# EAGLE design board (EAGLE 6.4)
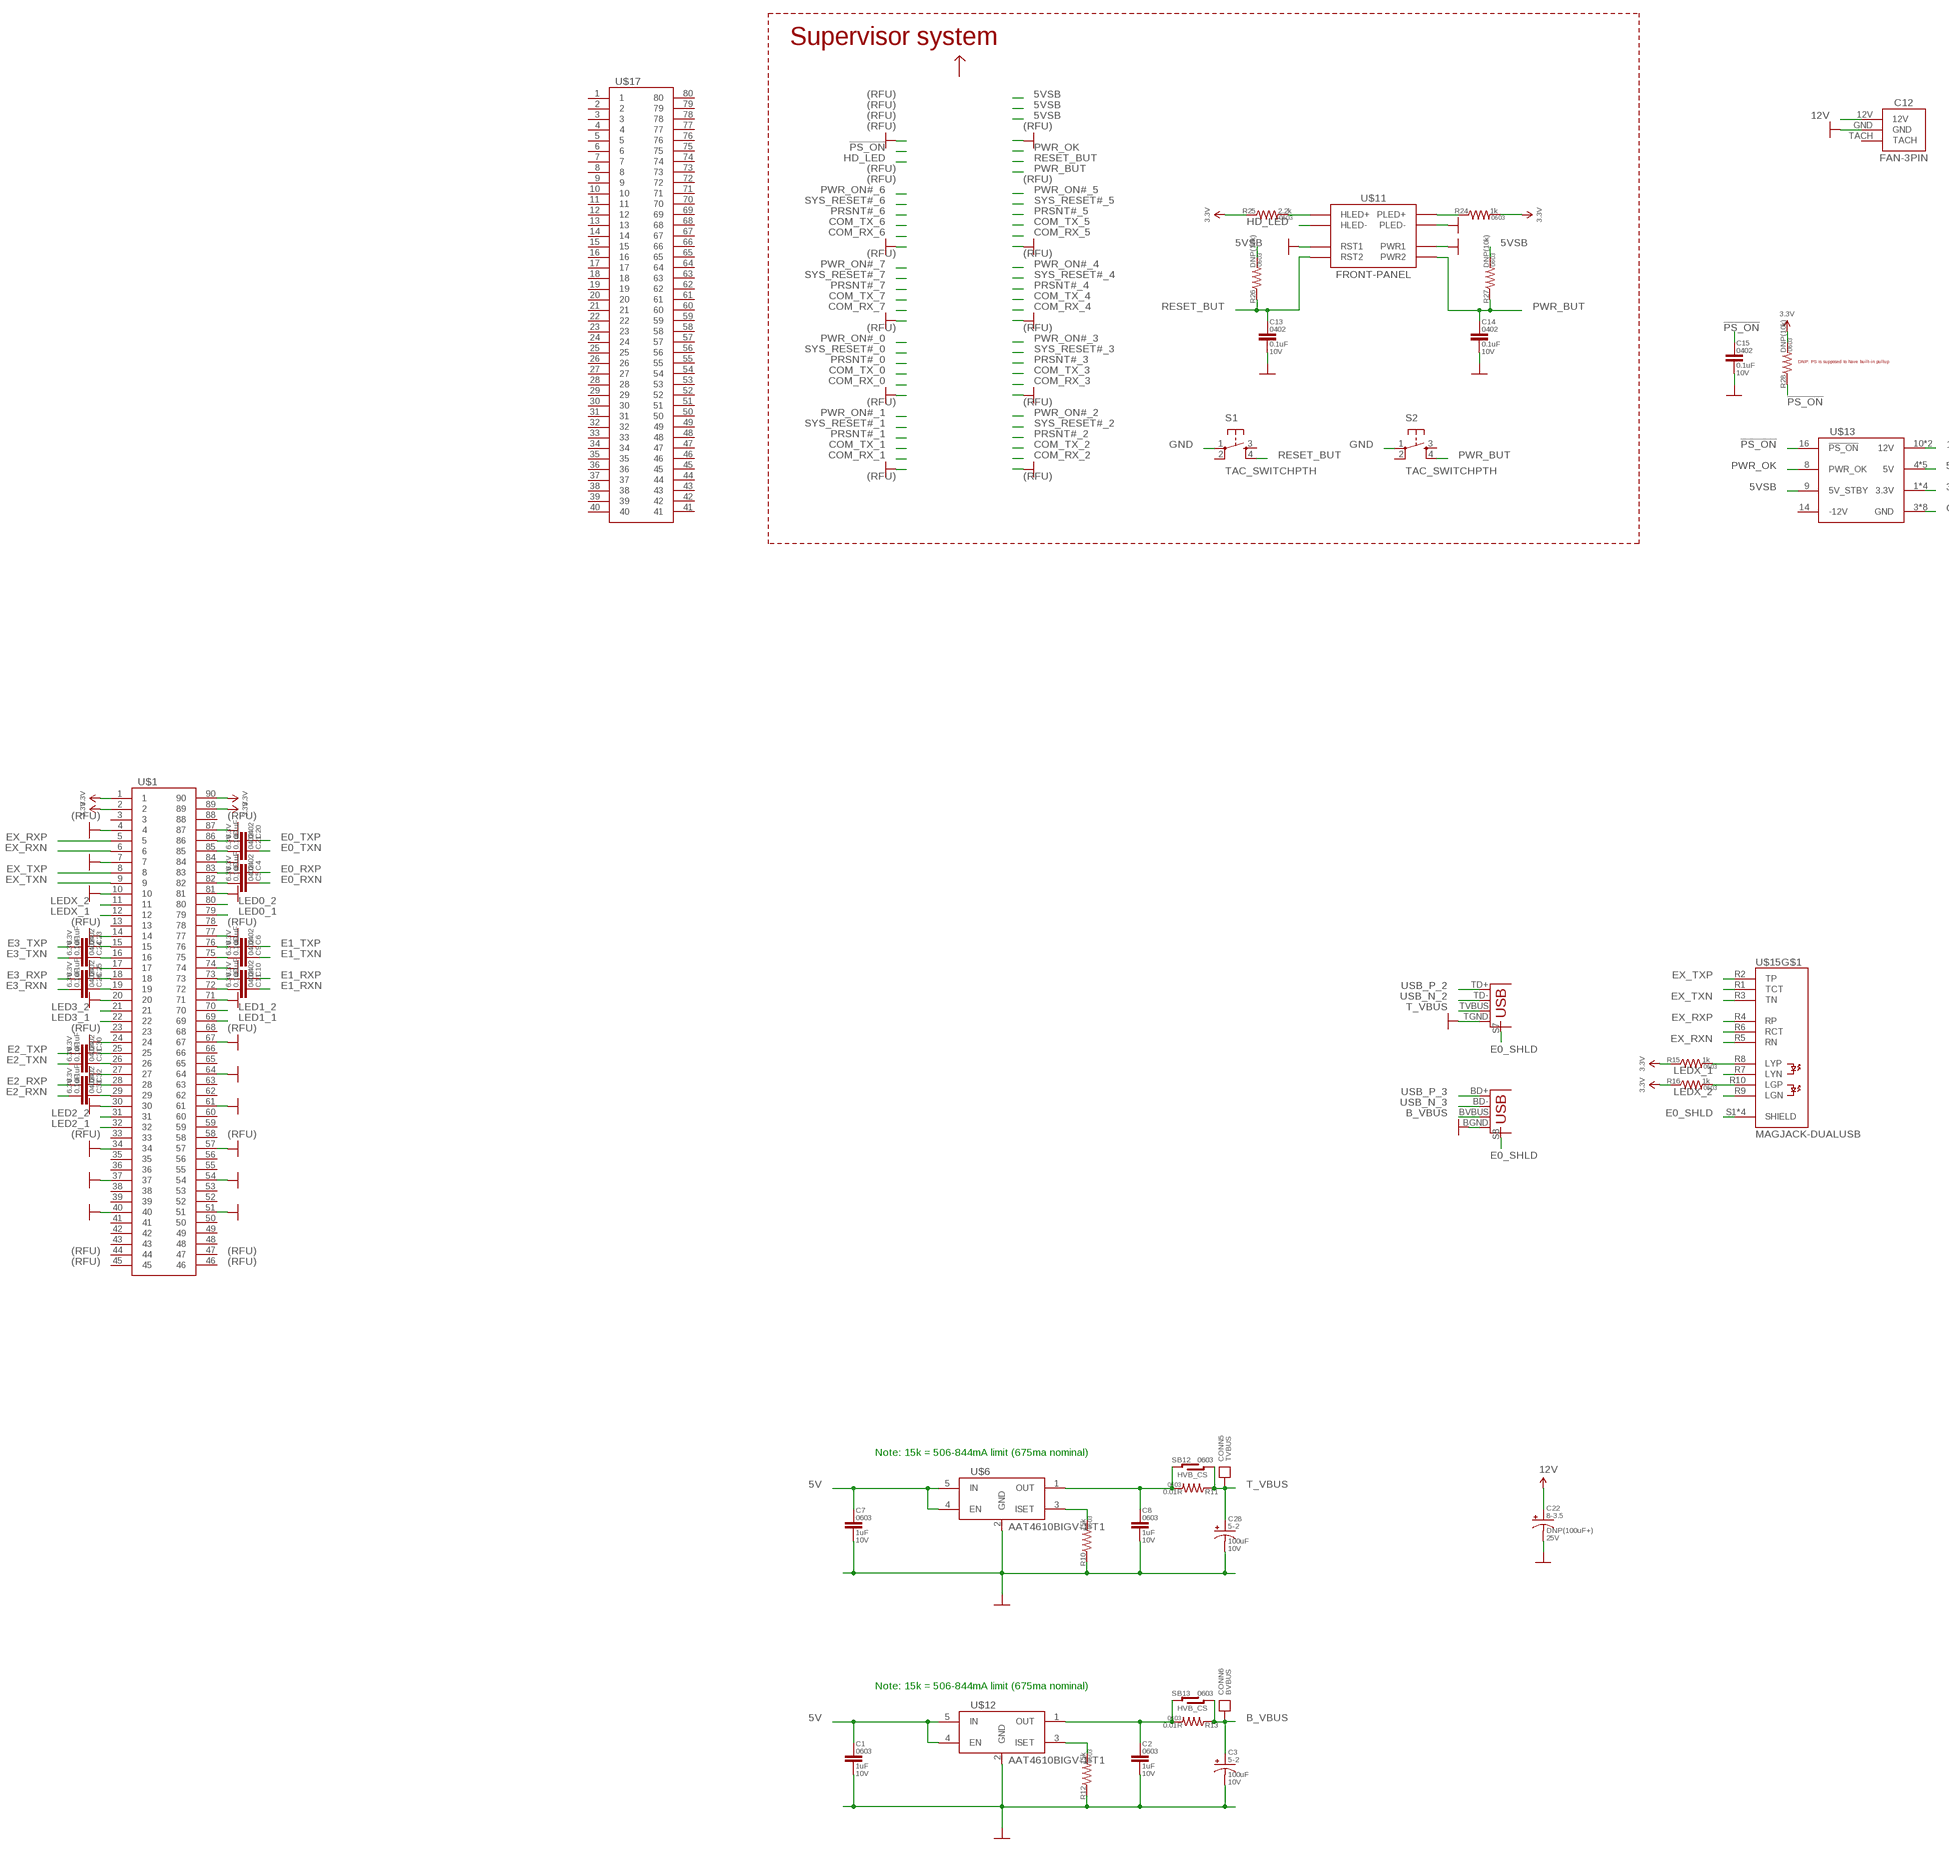
[diagram p0: schematic, sheet 1, part 1 of 2]
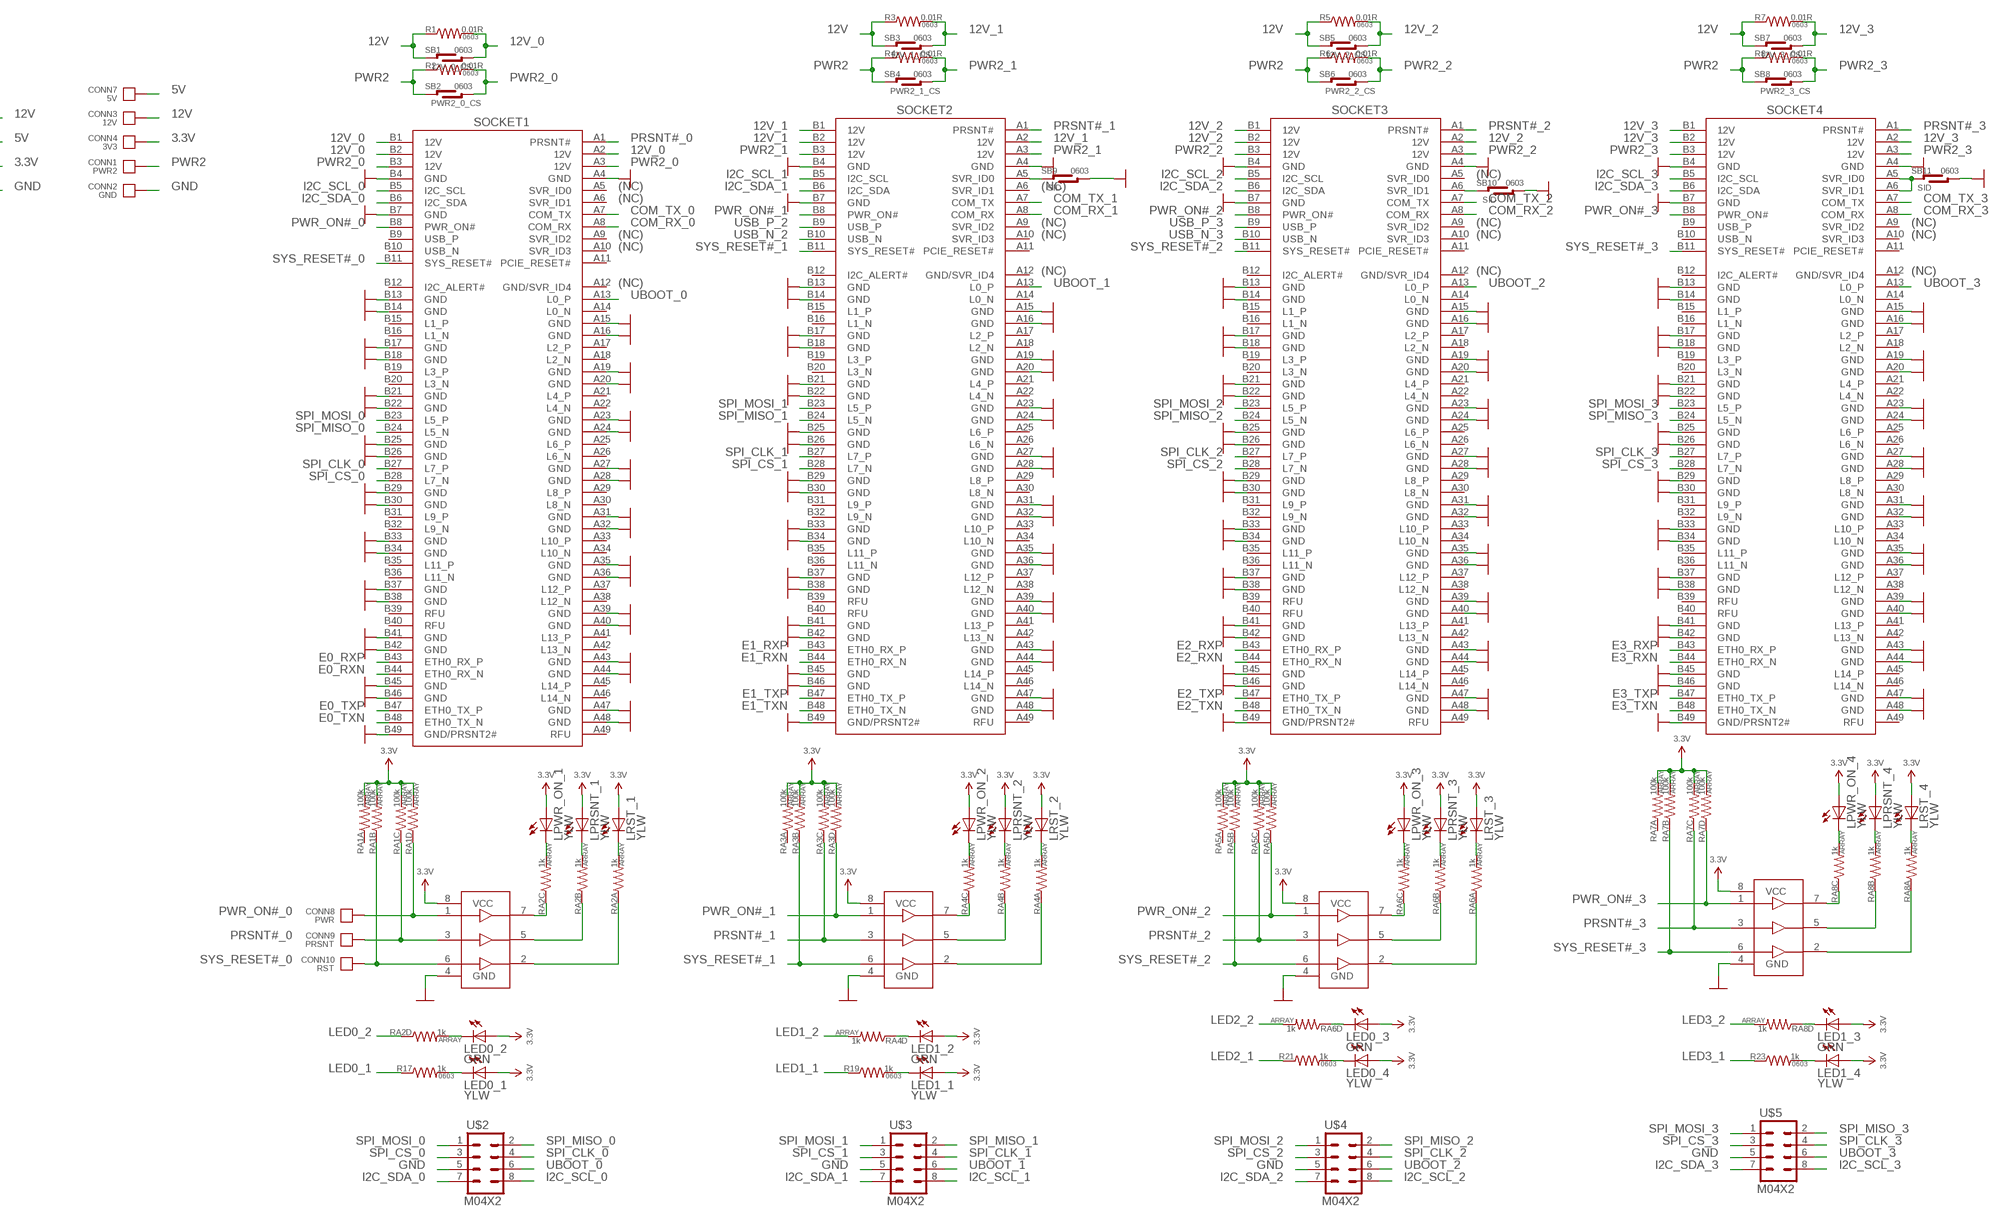
[diagram p1: schematic, sheet 1, part 2 of 2]

## Parts
C1  1uF  CAP0603  [0603-CAP]
C2  1uF  CAP0603  [0603-CAP]
C3  100uF  CAP_POLPTH-5-2  [CAP-5-2]
C4  0.1uF  CAP0402-CAP  [0402-CAP]
C5  0.1uF  CAP0402-CAP  [0402-CAP]
C6  0.1uF  CAP0402-CAP  [0402-CAP]
C7  1uF  CAP0603  [0603-CAP]
C8  1uF  CAP0603  [0603-CAP]
C9  0.1uF  CAP0402-CAP  [0402-CAP]
C10  0.1uF  CAP0402-CAP  [0402-CAP]
C11  0.1uF  CAP0402-CAP  [0402-CAP]
C12  FAN-3PIN  [FAN-3PIN]
C13  0.1uF  CAP0402-CAP  [0402-CAP]
C14  0.1uF  CAP0402-CAP  [0402-CAP]
C15  0.1uF  CAP0402-CAP  [0402-CAP]
C20  0.1uF  CAP0402-CAP  [0402-CAP]
C21  0.1uF  CAP0402-CAP  [0402-CAP]
C22  DNP(100uF+)  CAP_POLPTH-8-3.5  [CAP-8-3.5]
C23  0.1uF  CAP0402-CAP  [0402-CAP]
C24  0.1uF  CAP0402-CAP  [0402-CAP]
C25  0.1uF  CAP0402-CAP  [0402-CAP]
C26  0.1uF  CAP0402-CAP  [0402-CAP]
C28  100uF  CAP_POLPTH-5-2  [CAP-5-2]
C30  0.1uF  CAP0402-CAP  [0402-CAP]
C31  0.1uF  CAP0402-CAP  [0402-CAP]
C32  0.1uF  CAP0402-CAP  [0402-CAP]
C33  0.1uF  CAP0402-CAP  [0402-CAP]
CONN1  PWR2  CONNECTOR18AWG  [HOLE_18AWG]
CONN2  GND  CONNECTOR18AWG  [HOLE_18AWG]
CONN3  12V  CONNECTOR18AWG  [HOLE_18AWG]
CONN4  3V3  CONNECTOR18AWG  [HOLE_18AWG]
CONN5  TVBUS  CONNECTOR22AWG  [HOLE_22AWG]
CONN6  BVBUS  CONNECTOR22AWG  [HOLE_22AWG]
CONN7  5V  CONNECTOR18AWG  [HOLE_18AWG]
CONN8  PWR  CONNECTOR1.27  [TESTPAD-1.27]
CONN9  PRSNT  CONNECTOR1.27  [TESTPAD-1.27]
CONN10  RST  CONNECTOR1.27  [TESTPAD-1.27]
IC1  74X3G34  [TSSOP8]
IC2  74X3G34  [TSSOP8]
IC3  74X3G34  [TSSOP8]
IC4  74X3G34  [TSSOP8]
LED0_1  YLW  LED0603  [0603_LED]
LED0_2  GRN  LED0603  [0603_LED]
LED0_3  GRN  LED0603  [0603_LED]
LED0_4  YLW  LED0603  [0603_LED]
LED1_1  YLW  LED0603  [0603_LED]
LED1_2  GRN  LED0603  [0603_LED]
LED1_3  GRN  LED0603  [0603_LED]
LED1_4  YLW  LED0603  [0603_LED]
LPRSNT_1  YLW  LED0603  [0603_LED]
LPRSNT_2  YLW  LED0603  [0603_LED]
LPRSNT_3  YLW  LED0603  [0603_LED]
LPRSNT_4  YLW  LED0603  [0603_LED]
LPWR_ON_1  YLW  LED0603  [0603_LED]
LPWR_ON_2  YLW  LED0603  [0603_LED]
LPWR_ON_3  YLW  LED0603  [0603_LED]
LPWR_ON_4  YLW  LED0603  [0603_LED]
LRST_1  YLW  LED0603  [0603_LED]
LRST_2  YLW  LED0603  [0603_LED]
LRST_3  YLW  LED0603  [0603_LED]
LRST_4  YLW  LED0603  [0603_LED]
R1  0.01R  RESISTOR0603  [0603-RES]
R2  0.01R  RESISTOR0603  [0603-RES]
R3  0.01R  RESISTOR0603  [0603-RES]
R4  0.01R  RESISTOR0603  [0603-RES]
R5  0.01R  RESISTOR0603  [0603-RES]
R6  0.01R  RESISTOR0603  [0603-RES]
R7  0.01R  RESISTOR0603  [0603-RES]
R8  0.01R  RESISTOR0603  [0603-RES]
R10  15k  RESISTOR0603  [0603-RES]
R11  0.01R  RESISTOR0603  [0603-RES]
R12  15k  RESISTOR0603  [0603-RES]
R13  0.01R  RESISTOR0603  [0603-RES]
R15  1k  RESISTOR0603  [0603-RES]
R16  1k  RESISTOR0603  [0603-RES]
R17  1k  RESISTOR0603  [0603-RES]
R19  1k  RESISTOR0603  [0603-RES]
R21  1k  RESISTOR0603  [0603-RES]
R23  1k  RESISTOR0603  [0603-RES]
R24  1k  RESISTOR0603  [0603-RES]
R25  2.2k  RESISTOR0603  [0603-RES]
R26  DNP(10k)  RESISTOR0603  [0603-RES]
R27  DNP(10k)  RESISTOR0603  [0603-RES]
R28  DNP(10k)  RESISTOR0603  [0603-RES]
RA1  100k  RESISTOR_ARRAY0603_X4  [0603-ARV]
RA2  1k  RESISTOR_ARRAY0603_X4  [0603-ARV]
RA3  100k  RESISTOR_ARRAY0603_X4  [0603-ARV]
RA4  1k  RESISTOR_ARRAY0603_X4  [0603-ARV]
RA5  100k  RESISTOR_ARRAY0603_X4  [0603-ARV]
RA6  1k  RESISTOR_ARRAY0603_X4  [0603-ARV]
RA7  100k  RESISTOR_ARRAY0603_X4  [0603-ARV]
RA8  1k  RESISTOR_ARRAY0603_X4  [0603-ARV]
S1  TAC_SWITCHPTH  [TACTILE-PTH]
S2  TAC_SWITCHPTH  [TACTILE-PTH]
SB1  12V_0_CS  SOLDER-BRIDGE0603  [SB-0603]
SB2  PWR2_0_CS  SOLDER-BRIDGE0603  [SB-0603]
SB3  12V_1_CS  SOLDER-BRIDGE0603  [SB-0603]
SB4  PWR2_1_CS  SOLDER-BRIDGE0603  [SB-0603]
SB5  12V_2_CS  SOLDER-BRIDGE0603  [SB-0603]
SB6  PWR2_2_CS  SOLDER-BRIDGE0603  [SB-0603]
SB7  12V_3_CS  SOLDER-BRIDGE0603  [SB-0603]
SB8  PWR2_3_CS  SOLDER-BRIDGE0603  [SB-0603]
SB9  SID  SOLDER-BRIDGE0603  [SB-0603]
SB10  SID  SOLDER-BRIDGE0603  [SB-0603]
SB11  SID  SOLDER-BRIDGE0603  [SB-0603]
SB12  HVB_CS  SOLDER-BRIDGE0603  [SB-0603]
SB13  HVB_CS  SOLDER-BRIDGE0603  [SB-0603]
SOCKET1  COVEN-V1CONN  [CVN-V1-CONN]
SOCKET2  COVEN-V1CONN  [CVN-V1-CONN]
SOCKET3  COVEN-V1CONN  [CVN-V1-CONN]
SOCKET4  COVEN-V1CONN  [CVN-V1-CONN]
U$1  DF40-90RCP  [DF40-RCP-90]
U$2  M04X2  [2X4]
U$3  M04X2  [2X4]
U$4  M04X2  [2X4]
U$5  M04X2  [2X4]
U$6  AAT4610BIGV-1-T1  LOAD_SWITCH_ILIMIT  [SOT23-5]
U$11  FRONT-PANEL  [FRONT-PANEL]
U$12  AAT4610BIGV-1-T1  LOAD_SWITCH_ILIMIT  [SOT23-5]
U$13  ATX-PWRVERT  [ATX-24-VERT]
U$15  MAGJACK-DUALUSB  [MAGJACK-DUALUSB]
U$17  DF40-80RCP  [DF40-RCP-80]

## Nets
3.3V: CONN4.P$1(P) IC1.8(VCC) IC2.8(VCC) IC3.8(VCC) IC4.8(VCC) LED0_1.A LED0_2.A LED0_3.A LED0_4.A LED1_1.A LED1_2.A LED1_3.A LED1_4.A LPRSNT_1.A LPRSNT_2.A LPRSNT_3.A LPRSNT_4.A LPWR_ON_1.A LPWR_ON_2.A LPWR_ON_3.A LPWR_ON_4.A LRST_1.A LRST_2.A LRST_3.A LRST_4.A R15.1 R16.1 R24.2 R25.1 R28.2 RA1.5 RA1.6 RA1.7 RA1.8 RA3.5 RA3.6 RA3.7 RA3.8 RA5.5 RA5.6 RA5.7 RA5.8 RA7.5 RA7.6 RA7.7 RA7.8 U$1.1 U$1.2 U$1.89 U$1.90 U$13.1(3.3V) U$13.2(3.3V) U$13.12(3.3V) U$13.13(3.3V)
5V: C1.1 C7.1 CONN7.P$1(P) U$6.4(EN) U$6.5(IN) U$12.4(EN) U$12.5(IN) U$13.4(5V) U$13.6(5V) U$13.21(5V) U$13.22(5V) U$13.23(5V)
5VSB: R26.2 R27.2 U$13.9(5V_STBY)
12V: C12.12V C22.1(+) CONN3.P$1(P) R1.1 R3.1 R5.1 R7.1 SB1.L1 SB1.L2 SB3.L1 SB3.L2 SB5.L1 SB5.L2 SB7.L1 SB7.L2 U$13.10(12V) U$13.11(12V)
12V_0: R1.2 SB1.R1 SB1.R2 SOCKET1.A2(12V) SOCKET1.B1(12V) SOCKET1.B2(12V)
12V_1: R3.2 SB3.R1 SB3.R2 SOCKET2.A2(12V) SOCKET2.B1(12V) SOCKET2.B2(12V)
12V_2: R5.2 SB5.R1 SB5.R2 SOCKET3.A2(12V) SOCKET3.B1(12V) SOCKET3.B2(12V)
12V_3: R7.2 SB7.R1 SB7.R2 SOCKET4.A2(12V) SOCKET4.B1(12V) SOCKET4.B2(12V)
!PS_ON: C15.1 R28.1 U$13.16(!PS_ON)
B_VBUS: C3.1(+) CONN6.P R13.1 SB13.R1 SB13.R2 U$15.BVBUS(VBUS)
COM_RX_0: SOCKET1.A8(COM_RX)
COM_RX_1: SOCKET2.A8(COM_RX)
COM_RX_2: SOCKET3.A8(COM_RX)
COM_RX_3: SOCKET4.A8(COM_RX)
COM_TX_0: SOCKET1.A7(COM_TX)
COM_TX_1: SOCKET2.A7(COM_TX)
COM_TX_2: SOCKET3.A7(COM_TX)
COM_TX_3: SOCKET4.A7(COM_TX)
E0_RXN: C5.1 SOCKET1.B44(ETH0_RX_N)
E0_RXP: C4.1 SOCKET1.B43(ETH0_RX_P)
E0_SHLD: U$15.S1(SHIELD) U$15.S2(SHIELD) U$15.S3(SHIELD) U$15.S4(SHIELD) U$15.S7(SHELL) U$15.S8(SHELL)
E0_TXN: C21.1 SOCKET1.B48(ETH0_TX_N)
E0_TXP: C20.1 SOCKET1.B47(ETH0_TX_P)
E1_RXN: C11.1 SOCKET2.B44(ETH0_RX_N)
E1_RXP: C10.1 SOCKET2.B43(ETH0_RX_P)
E1_TXN: C9.1 SOCKET2.B48(ETH0_TX_N)
E1_TXP: C6.1 SOCKET2.B47(ETH0_TX_P)
E2_RXN: C33.2 SOCKET3.B44(ETH0_RX_N)
E2_RXP: C32.2 SOCKET3.B43(ETH0_RX_P)
E2_TXN: C31.2 SOCKET3.B48(ETH0_TX_N)
E2_TXP: C30.2 SOCKET3.B47(ETH0_TX_P)
E3_RXN: C26.2 SOCKET4.B44(ETH0_RX_N)
E3_RXP: C25.2 SOCKET4.B43(ETH0_RX_P)
E3_TXN: C24.2 SOCKET4.B48(ETH0_TX_N)
E3_TXP: C23.2 SOCKET4.B47(ETH0_TX_P)
EX_RXN: U$1.6 U$15.R5(RN)
EX_RXP: U$1.5 U$15.R4(RP)
EX_TXN: U$1.9 U$15.R3(TN)
EX_TXP: U$1.8 U$15.R2(TP)
GND: C1.2 C2.2 C3.2(-) C7.2 C8.2 C12.GND C13.2 C14.2 C15.2 C22.2(-) C28.2(-) CONN2.P$1(P) IC1.4(GND) IC2.4(GND) IC3.4(GND) IC4.4(GND) R10.1 R12.1 S1.1 S2.1 SB9.R1 SB9.R2 SB10.R1 SB10.R2 SB11.R1 SB11.R2 SOCKET1.A4(GND) SOCKET1.A15(GND) SOCKET1.A16(GND) SOCKET1.A19(GND) SOCKET1.A20(GND) SOCKET1.A23(GND) SOCKET1.A24(GND) SOCKET1.A27(GND) SOCKET1.A28(GND) SOCKET1.A31(GND) SOCKET1.A32(GND) SOCKET1.A35(GND) SOCKET1.A36(GND) SOCKET1.A39(GND) SOCKET1.A40(GND) SOCKET1.A43(GND) SOCKET1.A44(GND) SOCKET1.A47(GND) SOCKET1.A48(GND) SOCKET1.B4(GND) SOCKET1.B7(GND) SOCKET1.B13(GND) SOCKET1.B14(GND) SOCKET1.B17(GND) SOCKET1.B18(GND) SOCKET1.B21(GND) SOCKET1.B22(GND) SOCKET1.B25(GND) SOCKET1.B26(GND) SOCKET1.B29(GND) SOCKET1.B30(GND) SOCKET1.B33(GND) SOCKET1.B34(GND) SOCKET1.B37(GND) SOCKET1.B38(GND) SOCKET1.B41(GND) SOCKET1.B42(GND) SOCKET1.B45(GND) SOCKET1.B46(GND) SOCKET1.B49(GND/PRSNT2#) SOCKET2.A4(GND) SOCKET2.A15(GND) SOCKET2.A16(GND) SOCKET2.A19(GND) SOCKET2.A20(GND) SOCKET2.A23(GND) SOCKET2.A24(GND) SOCKET2.A27(GND) SOCKET2.A28(GND) SOCKET2.A31(GND) SOCKET2.A32(GND) SOCKET2.A35(GND) SOCKET2.A36(GND) SOCKET2.A39(GND) SOCKET2.A40(GND) SOCKET2.A43(GND) SOCKET2.A44(GND) SOCKET2.A47(GND) SOCKET2.A48(GND) SOCKET2.B4(GND) SOCKET2.B7(GND) SOCKET2.B13(GND) SOCKET2.B14(GND) SOCKET2.B17(GND) SOCKET2.B18(GND) SOCKET2.B21(GND) SOCKET2.B22(GND) SOCKET2.B25(GND) SOCKET2.B26(GND) SOCKET2.B29(GND) SOCKET2.B30(GND) SOCKET2.B33(GND) SOCKET2.B34(GND) SOCKET2.B37(GND) SOCKET2.B38(GND) SOCKET2.B41(GND) SOCKET2.B42(GND) SOCKET2.B45(GND) SOCKET2.B46(GND) SOCKET2.B49(GND/PRSNT2#) SOCKET3.A4(GND) SOCKET3.A15(GND) SOCKET3.A16(GND) SOCKET3.A19(GND) SOCKET3.A20(GND) SOCKET3.A23(GND) SOCKET3.A24(GND) SOCKET3.A27(GND) SOCKET3.A28(GND) SOCKET3.A31(GND) SOCKET3.A32(GND) SOCKET3.A35(GND) SOCKET3.A36(GND) SOCKET3.A39(GND) SOCKET3.A40(GND) SOCKET3.A43(GND) SOCKET3.A44(GND) SOCKET3.A47(GND) SOCKET3.A48(GND) SOCKET3.B4(GND) SOCKET3.B7(GND) SOCKET3.B13(GND) SOCKET3.B14(GND) SOCKET3.B17(GND) SOCKET3.B18(GND) SOCKET3.B21(GND) SOCKET3.B22(GND) SOCKET3.B25(GND) SOCKET3.B26(GND) SOCKET3.B29(GND) SOCKET3.B30(GND) SOCKET3.B33(GND) SOCKET3.B34(GND) SOCKET3.B37(GND) SOCKET3.B38(GND) SOCKET3.B41(GND) SOCKET3.B42(GND) SOCKET3.B45(GND) SOCKET3.B46(GND) SOCKET3.B49(GND/PRSNT2#) SOCKET4.A4(GND) SOCKET4.A15(GND) SOCKET4.A16(GND) SOCKET4.A19(GND) SOCKET4.A20(GND) SOCKET4.A23(GND) SOCKET4.A24(GND) SOCKET4.A27(GND) SOCKET4.A28(GND) SOCKET4.A31(GND) SOCKET4.A32(GND) SOCKET4.A35(GND) SOCKET4.A36(GND) SOCKET4.A39(GND) SOCKET4.A40(GND) SOCKET4.A43(GND) SOCKET4.A44(GND) SOCKET4.A47(GND) SOCKET4.A48(GND) SOCKET4.B4(GND) SOCKET4.B7(GND) SOCKET4.B13(GND) SOCKET4.B14(GND) SOCKET4.B17(GND) SOCKET4.B18(GND) SOCKET4.B21(GND) SOCKET4.B22(GND) SOCKET4.B25(GND) SOCKET4.B26(GND) SOCKET4.B29(GND) SOCKET4.B30(GND) SOCKET4.B33(GND) SOCKET4.B34(GND) SOCKET4.B37(GND) SOCKET4.B38(GND) SOCKET4.B41(GND) SOCKET4.B42(GND) SOCKET4.B45(GND) SOCKET4.B46(GND) SOCKET4.B49(GND/PRSNT2#) U$1.4 U$1.7 U$1.10 U$1.14 U$1.17 U$1.20 U$1.24 U$1.27 U$1.30 U$1.34 U$1.37 U$1.40 U$1.51 U$1.54 U$1.57 U$1.61 U$1.64 U$1.67 U$1.71 U$1.74 U$1.77 U$1.81 U$1.84 U$1.87 U$2.5 U$3.5 U$4.5 U$5.5 U$6.2(GND) U$11.PLED- U$11.PWR_1(PWR1) U$11.RST_1(RST1) U$12.2(GND) U$13.3(GND) U$13.5(GND) U$13.7(GND) U$13.15(GND) U$13.17(GND) U$13.18(GND) U$13.19(GND) U$13.24(GND) U$15.BGND(GND) U$15.TGND(GND)
HD_LED: U$11.HDLED-(HLED-)
HOST_VBUS_U: C8.1 R11.2 SB12.L1 SB12.L2 U$6.1(OUT)
HOST_VBUS_U1: C2.1 R13.2 SB13.L1 SB13.L2 U$12.1(OUT)
I2C_SCL_0: SOCKET1.B5(I2C_SCL) U$2.8
I2C_SCL_1: SOCKET2.B5(I2C_SCL) U$3.8
I2C_SCL_2: SOCKET3.B5(I2C_SCL) U$4.8
I2C_SCL_3: SOCKET4.B5(I2C_SCL) U$5.8
I2C_SDA_0: SOCKET1.B6(I2C_SDA) U$2.7
I2C_SDA_1: SOCKET2.B6(I2C_SDA) U$3.7
I2C_SDA_2: SOCKET3.B6(I2C_SDA) U$4.7
I2C_SDA_3: SOCKET4.B6(I2C_SDA) U$5.7
LED0_1: R17.1 U$1.79
LED0_2: RA2.4 U$1.80
LED1_1: R19.1 U$1.69
LED1_2: RA4.5 U$1.70
LED2_1: R21.1 U$1.32
LED2_2: RA6.5 U$1.31
LED3_1: R23.1 U$1.22
LED3_2: RA8.5 U$1.21
LEDX_1: U$1.12 U$15.R7(LYN)
LEDX_2: U$1.11 U$15.R9(LGN)
N$1: SB9.L1 SB9.L2 SOCKET2.A5(SVR_ID0)
N$2: SB11.L1 SB11.L2 SOCKET4.A5(SVR_ID0) SOCKET4.A6(SVR_ID1)
N$3: SB10.L1 SB10.L2 SOCKET3.A6(SVR_ID1)
N$4: IC2.7(1Y) RA4.3
N$5: IC2.5(2Y) RA4.2
N$6: LPWR_ON_2.C RA4.6
N$7: LPWR_ON_1.C RA2.6
N$8: LPRSNT_1.C RA2.7
N$9: IC1.7(1Y) RA2.3
N$10: IC1.5(2Y) RA2.2
N$11: IC1.2(3Y) RA2.1
N$12: LRST_1.C RA2.8
N$13: LPRSNT_2.C RA4.7
N$14: IC2.2(3Y) RA4.1
N$15: LRST_2.C RA4.8
N$16: IC3.7(1Y) RA6.3
N$17: IC3.5(2Y) RA6.2
N$18: LPWR_ON_3.C RA6.6
N$19: LPRSNT_3.C RA6.7
N$20: IC3.2(3Y) RA6.1
N$21: LRST_3.C RA6.8
N$22: IC4.7(1Y) RA8.3
N$23: IC4.5(2Y) RA8.2
N$24: LPWR_ON_4.C RA8.6
N$25: LPRSNT_4.C RA8.7
N$26: IC4.2(3Y) RA8.1
N$27: LRST_4.C RA8.8
N$28: C11.2 U$1.72
N$29: C10.2 U$1.73
N$30: R10.2 U$6.3(ISET)
N$31: R12.2 U$12.3(ISET)
N$32: U$15.R1(TCT)
N$33: U$15.R6(RCT)
N$34: R25.2 U$11.HDLED+(HLED+)
N$35: R15.2 U$15.R8(LYP)
N$39: C9.2 U$1.75
N$40: R16.2 U$15.R10(LGP)
N$41: C6.2 U$1.76
N$42: R24.1 U$11.PLED+
N$43: C5.2 U$1.82
N$44: C4.2 U$1.83
N$45: C21.2 U$1.85
N$46: C20.2 U$1.86
N$49: C33.1 U$1.29
N$50: C32.1 U$1.28
N$51: C31.1 U$1.26
N$52: C30.1 U$1.25
N$53: C25.1 U$1.18
N$54: C24.1 U$1.16
N$55: C23.1 U$1.15
N$56: LED0_1.C R17.2
N$57: LED0_2.C RA2.5
N$58: LED1_2.C RA4.4
N$59: LED1_1.C R19.2
N$60: LED0_3.C RA6.4
N$61: LED0_4.C R21.2
N$62: LED1_3.C RA8.4
N$63: LED1_4.C R23.2
N$96: C26.1 U$1.19
PRSNT#_0: CONN9.P IC1.3(2A) RA1.3 SOCKET1.A1(PRSNT#)
PRSNT#_1: IC2.3(2A) RA3.3 SOCKET2.A1(PRSNT#)
PRSNT#_2: IC3.3(2A) RA5.3 SOCKET3.A1(PRSNT#)
PRSNT#_3: IC4.3(2A) RA7.3 SOCKET4.A1(PRSNT#)
PWR2: CONN1.P$1(P) R2.1 R4.1 R6.1 R8.1 SB2.L1 SB2.L2 SB4.L1 SB4.L2 SB6.L1 SB6.L2 SB8.L1 SB8.L2
PWR2_0: R2.2 SB2.R1 SB2.R2 SOCKET1.A3(12V) SOCKET1.B3(12V)
PWR2_1: R4.2 SB4.R1 SB4.R2 SOCKET2.A3(12V) SOCKET2.B3(12V)
PWR2_2: R6.2 SB6.R1 SB6.R2 SOCKET3.A3(12V) SOCKET3.B3(12V)
PWR2_3: R8.2 SB8.R1 SB8.R2 SOCKET4.A3(12V) SOCKET4.B3(12V)
PWR_BUT: C14.1 R27.1 S2.4 U$11.PWR_2(PWR2)
PWR_OK: U$13.8(PWR_OK)
PWR_ON#_0: CONN8.P IC1.1(1A) RA1.4 SOCKET1.B8(PWR_ON#)
PWR_ON#_1: IC2.1(1A) RA3.4 SOCKET2.B8(PWR_ON#)
PWR_ON#_2: IC3.1(1A) RA5.4 SOCKET3.B8(PWR_ON#)
PWR_ON#_3: IC4.1(1A) RA7.4 SOCKET4.B8(PWR_ON#)
RESET_BUT: C13.1 R26.1 S1.4 U$11.RST_2(RST2)
SPI_CLK_0: SOCKET1.B27(L7_P) U$2.4
SPI_CLK_1: SOCKET2.B27(L7_P) U$3.4
SPI_CLK_2: SOCKET3.B27(L7_P) U$4.4
SPI_CLK_3: SOCKET4.B27(L7_P) U$5.4
SPI_CS_0: SOCKET1.B28(L7_N) U$2.3
SPI_CS_1: SOCKET2.B28(L7_N) U$3.3
SPI_CS_2: SOCKET3.B28(L7_N) U$4.3
SPI_CS_3: SOCKET4.B28(L7_N) U$5.3
SPI_MISO_0: SOCKET1.B24(L5_N) U$2.2
SPI_MISO_1: SOCKET2.B24(L5_N) U$3.2
SPI_MISO_2: SOCKET3.B24(L5_N) U$4.2
SPI_MISO_3: SOCKET4.B24(L5_N) U$5.2
SPI_MOSI_0: SOCKET1.B23(L5_P) U$2.1
SPI_MOSI_1: SOCKET2.B23(L5_P) U$3.1
SPI_MOSI_2: SOCKET3.B23(L5_P) U$4.1
SPI_MOSI_3: SOCKET4.B23(L5_P) U$5.1
SYS_RESET#_0: CONN10.P IC1.6(3A) RA1.2 SOCKET1.B11(SYS_RESET#)
SYS_RESET#_1: IC2.6(3A) RA3.2 SOCKET2.B11(SYS_RESET#)
SYS_RESET#_2: IC3.6(3A) RA5.2 SOCKET3.B11(SYS_RESET#)
SYS_RESET#_3: IC4.6(3A) RA7.2 SOCKET4.B11(SYS_RESET#)
T_VBUS: C28.1(+) CONN5.P R11.1 SB12.R1 SB12.R2 U$15.TVBUS(VBUS)
UBOOT_0: SOCKET1.A13(L0_P) U$2.6
UBOOT_1: SOCKET2.A13(L0_P) U$3.6
UBOOT_2: SOCKET3.A13(L0_P) U$4.6
UBOOT_3: SOCKET4.A13(L0_P) U$5.6
USB_N_2: SOCKET2.B10(USB_N) U$15.TD-(D-)
USB_N_3: SOCKET3.B10(USB_N) U$15.BD-(D-)
USB_P_2: SOCKET2.B9(USB_P) U$15.TD+(D+)
USB_P_3: SOCKET3.B9(USB_P) U$15.BD+(D+)
Unconnected: C12.TACH RA1.1 RA3.1 RA5.1 RA7.1 S1.2 S1.3 S2.2 S2.3 SOCKET1.A5(SVR_ID0) SOCKET1.A6(SVR_ID1) SOCKET1.A9(SVR_ID2) SOCKET1.A10(SVR_ID3) SOCKET1.A11(PCIE_RESET#) SOCKET1.A12(GND/SVR_ID4) SOCKET1.A14(L0_N) SOCKET1.A17(L2_P) SOCKET1.A18(L2_N) SOCKET1.A21(L4_P) SOCKET1.A22(L4_N) SOCKET1.A25(L6_P) SOCKET1.A26(L6_N) SOCKET1.A29(L8_P) SOCKET1.A30(L8_N) SOCKET1.A33(L10_P) SOCKET1.A34(L10_N) SOCKET1.A37(L12_P) SOCKET1.A38(L12_N) SOCKET1.A41(L13_P) SOCKET1.A42(L13_N) SOCKET1.A45(L14_P) SOCKET1.A46(L14_N) SOCKET1.A49(RFU) SOCKET1.B9(USB_P) SOCKET1.B10(USB_N) SOCKET1.B12(I2C_ALERT#) SOCKET1.B15(L1_P) SOCKET1.B16(L1_N) SOCKET1.B19(L3_P) SOCKET1.B20(L3_N) SOCKET1.B31(L9_P) SOCKET1.B32(L9_N) SOCKET1.B35(L11_P) SOCKET1.B36(L11_N) SOCKET1.B39(RFU) SOCKET1.B40(RFU) SOCKET2.A6(SVR_ID1) SOCKET2.A9(SVR_ID2) SOCKET2.A10(SVR_ID3) SOCKET2.A11(PCIE_RESET#) SOCKET2.A12(GND/SVR_ID4) SOCKET2.A14(L0_N) SOCKET2.A17(L2_P) SOCKET2.A18(L2_N) SOCKET2.A21(L4_P) SOCKET2.A22(L4_N) SOCKET2.A25(L6_P) SOCKET2.A26(L6_N) SOCKET2.A29(L8_P) SOCKET2.A30(L8_N) SOCKET2.A33(L10_P) SOCKET2.A34(L10_N) SOCKET2.A37(L12_P) SOCKET2.A38(L12_N) SOCKET2.A41(L13_P) SOCKET2.A42(L13_N) SOCKET2.A45(L14_P) SOCKET2.A46(L14_N) SOCKET2.A49(RFU) SOCKET2.B12(I2C_ALERT#) SOCKET2.B15(L1_P) SOCKET2.B16(L1_N) SOCKET2.B19(L3_P) SOCKET2.B20(L3_N) SOCKET2.B31(L9_P) SOCKET2.B32(L9_N) SOCKET2.B35(L11_P) SOCKET2.B36(L11_N) SOCKET2.B39(RFU) SOCKET2.B40(RFU) SOCKET3.A5(SVR_ID0) SOCKET3.A9(SVR_ID2) SOCKET3.A10(SVR_ID3) SOCKET3.A11(PCIE_RESET#) SOCKET3.A12(GND/SVR_ID4) SOCKET3.A14(L0_N) SOCKET3.A17(L2_P) SOCKET3.A18(L2_N) SOCKET3.A21(L4_P) SOCKET3.A22(L4_N) SOCKET3.A25(L6_P) SOCKET3.A26(L6_N) SOCKET3.A29(L8_P) SOCKET3.A30(L8_N) SOCKET3.A33(L10_P) SOCKET3.A34(L10_N) SOCKET3.A37(L12_P) SOCKET3.A38(L12_N) SOCKET3.A41(L13_P) SOCKET3.A42(L13_N) SOCKET3.A45(L14_P) SOCKET3.A46(L14_N) SOCKET3.A49(RFU) SOCKET3.B12(I2C_ALERT#) SOCKET3.B15(L1_P) SOCKET3.B16(L1_N) SOCKET3.B19(L3_P) SOCKET3.B20(L3_N) SOCKET3.B31(L9_P) SOCKET3.B32(L9_N) SOCKET3.B35(L11_P) SOCKET3.B36(L11_N) SOCKET3.B39(RFU) SOCKET3.B40(RFU) SOCKET4.A9(SVR_ID2) SOCKET4.A10(SVR_ID3) SOCKET4.A11(PCIE_RESET#) SOCKET4.A12(GND/SVR_ID4) SOCKET4.A14(L0_N) SOCKET4.A17(L2_P) SOCKET4.A18(L2_N) SOCKET4.A21(L4_P) SOCKET4.A22(L4_N) SOCKET4.A25(L6_P) SOCKET4.A26(L6_N) SOCKET4.A29(L8_P) SOCKET4.A30(L8_N) SOCKET4.A33(L10_P) SOCKET4.A34(L10_N) SOCKET4.A37(L12_P) SOCKET4.A38(L12_N) SOCKET4.A41(L13_P) SOCKET4.A42(L13_N) SOCKET4.A45(L14_P) SOCKET4.A46(L14_N) SOCKET4.A49(RFU) SOCKET4.B9(USB_P) SOCKET4.B10(USB_N) SOCKET4.B12(I2C_ALERT#) SOCKET4.B15(L1_P) SOCKET4.B16(L1_N) SOCKET4.B19(L3_P) SOCKET4.B20(L3_N) SOCKET4.B31(L9_P) SOCKET4.B32(L9_N) SOCKET4.B35(L11_P) SOCKET4.B36(L11_N) SOCKET4.B39(RFU) SOCKET4.B40(RFU) U$1.3 U$1.13 U$1.23 U$1.33 U$1.35 U$1.36 U$1.38 U$1.39 U$1.41 U$1.42 U$1.43 U$1.44 U$1.45 U$1.46 U$1.47 U$1.48 U$1.49 U$1.50 U$1.52 U$1.53 U$1.55 U$1.56 U$1.58 U$1.59 U$1.60 U$1.62 U$1.63 U$1.65 U$1.66 U$1.68 U$1.78 U$1.88 U$13.14(-12V) U$17.1 U$17.2 U$17.3 U$17.4 U$17.5 U$17.6 U$17.7 U$17.8 U$17.9 U$17.10 U$17.11 U$17.12 U$17.13 U$17.14 U$17.15 U$17.16 U$17.17 U$17.18 U$17.19 U$17.20 U$17.21 U$17.22 U$17.23 U$17.24 U$17.25 U$17.26 U$17.27 U$17.28 U$17.29 U$17.30 U$17.31 U$17.32 U$17.33 U$17.34 U$17.35 U$17.36 U$17.37 U$17.38 U$17.39 U$17.40 U$17.41 U$17.42 U$17.43 U$17.44 U$17.45 U$17.46 U$17.47 U$17.48 U$17.49 U$17.50 U$17.51 U$17.52 U$17.53 U$17.54 U$17.55 U$17.56 U$17.57 U$17.58 U$17.59 U$17.60 U$17.61 U$17.62 U$17.63 U$17.64 U$17.65 U$17.66 U$17.67 U$17.68 U$17.69 U$17.70 U$17.71 U$17.72 U$17.73 U$17.74 U$17.75 U$17.76 U$17.77 U$17.78 U$17.79 U$17.80

## Notes on the sheet
- Supervisor system
- (RFU)
- (RFU)
- (RFU)
- (RFU) | (RFU)
- (RFU)
- (RFU) | (RFU)
- (RFU) | (RFU)
- (RFU) | (RFU)
- DNP: PS is supposed to have built-in pullup
- (RFU) | (RFU)
- (RFU) | (RFU)
- (NC)
- (NC) | (NC)
- (NC)
- (NC) | (NC) | (NC)
- (NC) | (NC) | (NC) | (NC)
- (NC)
- (NC) | (NC) | (NC)
- (NC)
- (RFU) | (RFU)
- (RFU) | (RFU)
- (RFU) | (RFU)
- (RFU) | (RFU)
- (RFU) | (RFU)
- (RFU) | (RFU)
- Note: 15k = 506-844mA limit (675ma nominal)
- Note: 15k = 506-844mA limit (675ma nominal)

## Library data of the parts
C1 C2 C7 C8 = kmod-passives:CAP: Capacitor Standard 0603 ceramic capacitor, and 0.1" leaded capacitor.; PACKAGE: 0603; VOLTAGE: 10V
C3 C28 = kmod-passives:CAP_POL: Capacitor Polarized These are standard SMD and PTH capacitors. Normally 10uF, 47uF, and 100uF in electrolytic and tantalum varieties. Always verify the external diameter of the through hole cap, it varies with capacity, voltage, and manufacturer. The EIA devices should be standard.; PACKAGE: 5-2; VOLTAGE: 10V
C4-C6 C9-C11 C20 C21 C23-C26 C30-C33 = kmod-passives:CAP: Capacitor Standard 0603 ceramic capacitor, and 0.1" leaded capacitor.; PACKAGE: 0402; VOLTAGE: 6.3V
C12 = kmod-connectors:FAN-3PIN
C13-C15 = kmod-passives:CAP: Capacitor Standard 0603 ceramic capacitor, and 0.1" leaded capacitor.; PACKAGE: 0402; VOLTAGE: 10V
C22 = kmod-passives:CAP_POL: Capacitor Polarized These are standard SMD and PTH capacitors. Normally 10uF, 47uF, and 100uF in electrolytic and tantalum varieties. Always verify the external diameter of the through hole cap, it varies with capacity, voltage, and manufacturer. The EIA devices should be standard.; PACKAGE: 8-3.5; VOLTAGE: 25V
CONN1-CONN10 = kmod-nonparts:CONNECTOR: Collection of holes/pads for testing/connecting
IC1-IC4 = kmod-testing:74X3G34: Triple buffer
LED0_1-LED0_4 LED1_1-LED1_4 LPRSNT_1-LPRSNT_4 LPWR_ON_1-LPWR_ON_4 LRST_1-LRST_4 = kmod-passives:LED
R1-R8 R10-R13 R15-R17 R19 R21 R23-R28 = kmod-passives:RESISTOR: Resistor Basic schematic elements and footprints for 0603, 1206, and PTH resistors.; PACKAGE: 0603
RA1-RA8 = kmod-passives:RESISTOR_ARRAY; PACKAGE: ARRAY
S1 S2 = kmod-mechanical:TAC_SWITCH: Momentary Switch Button commonly used for reset or general input. Spark Fun Electronics SKU : COM-00097 SMT- SWCH-08247
SB1-SB13 = kmod-nonparts:SOLDER-BRIDGE; PACKAGE: 0603
SOCKET1-SOCKET4 = kmod-connectors:COVEN-V1
U$1 = kmod-connectors:DF40-90
U$2-U$5 = SparkFun-Connectors:M04X2: .1" header, two rows of four.
U$6 U$12 = kmod-ics:LOAD_SWITCH_ILIMIT: Current-limited high-side load switch Such as for USB vbus. Note: active-high enable.
U$11 = kmod-connectors:FRONT-PANEL
U$13 = kmod-connectors:ATX-PWR
U$15 = kmod-connectors:MAGJACK-DUALUSB
U$17 = kmod-connectors:DF40-80

## Board
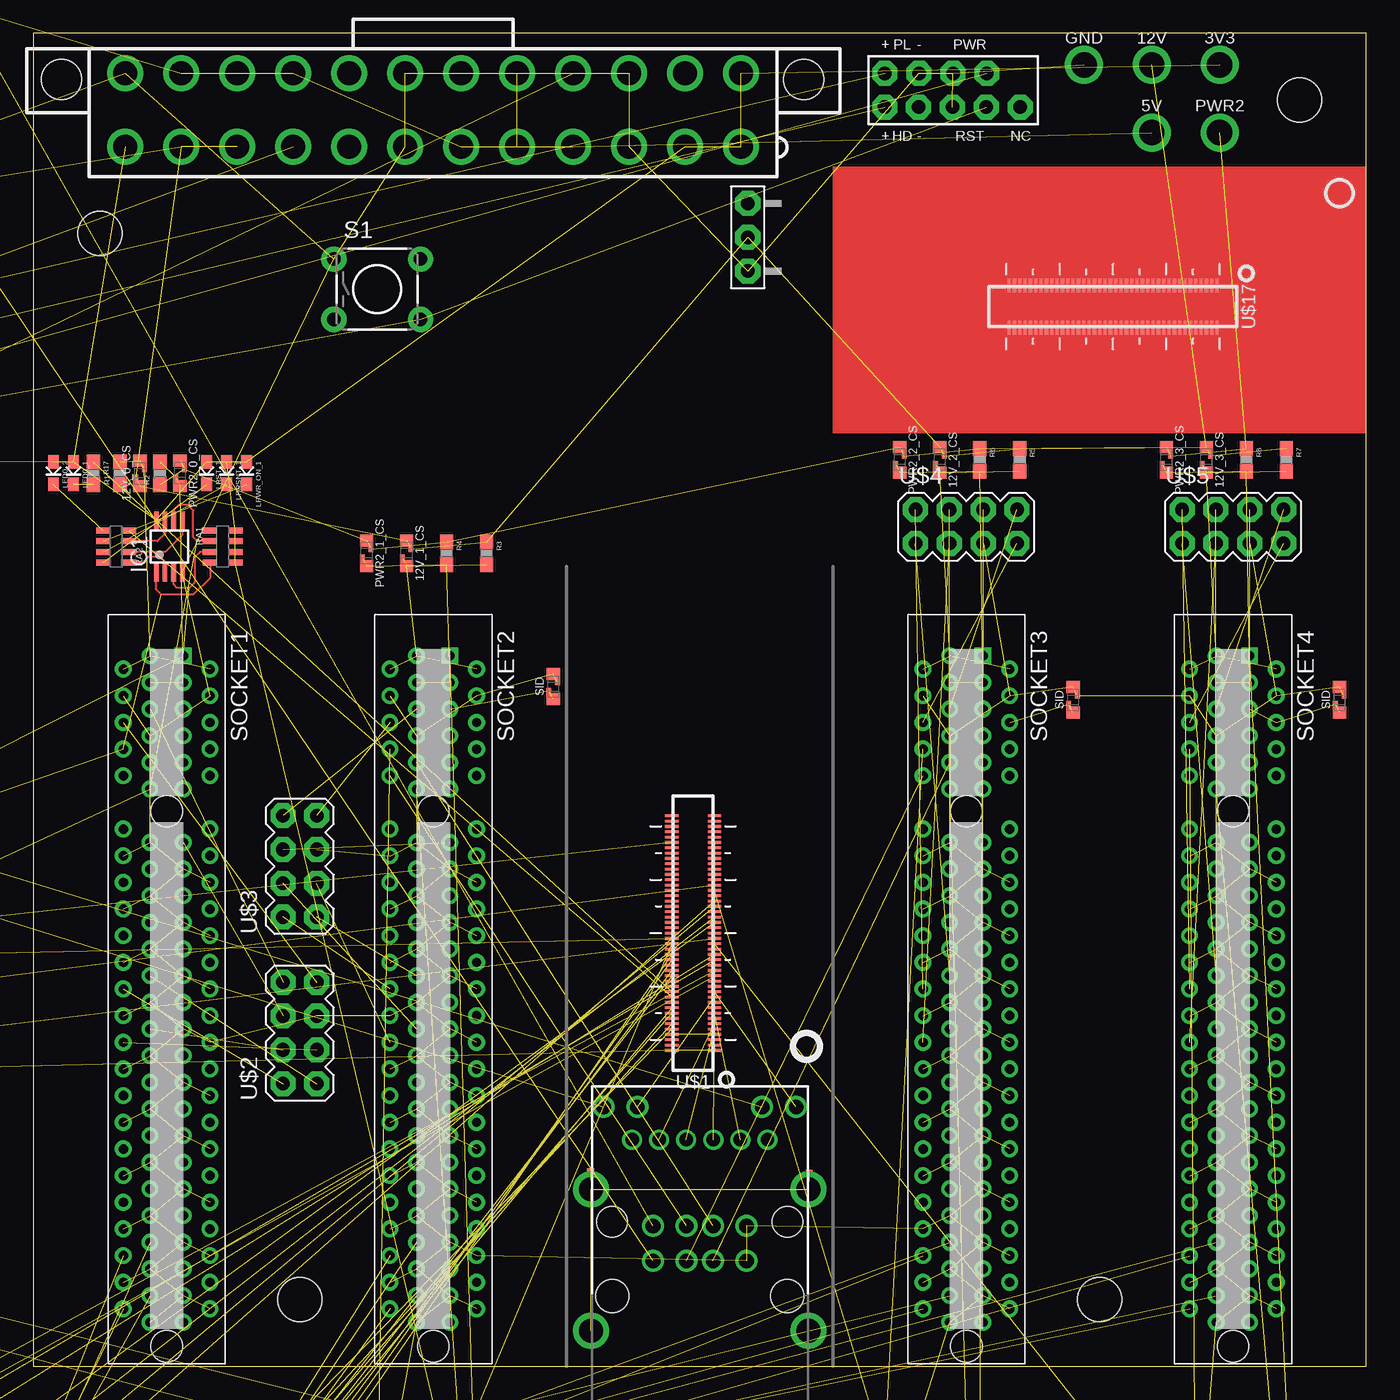
[diagram p2: board, top side]
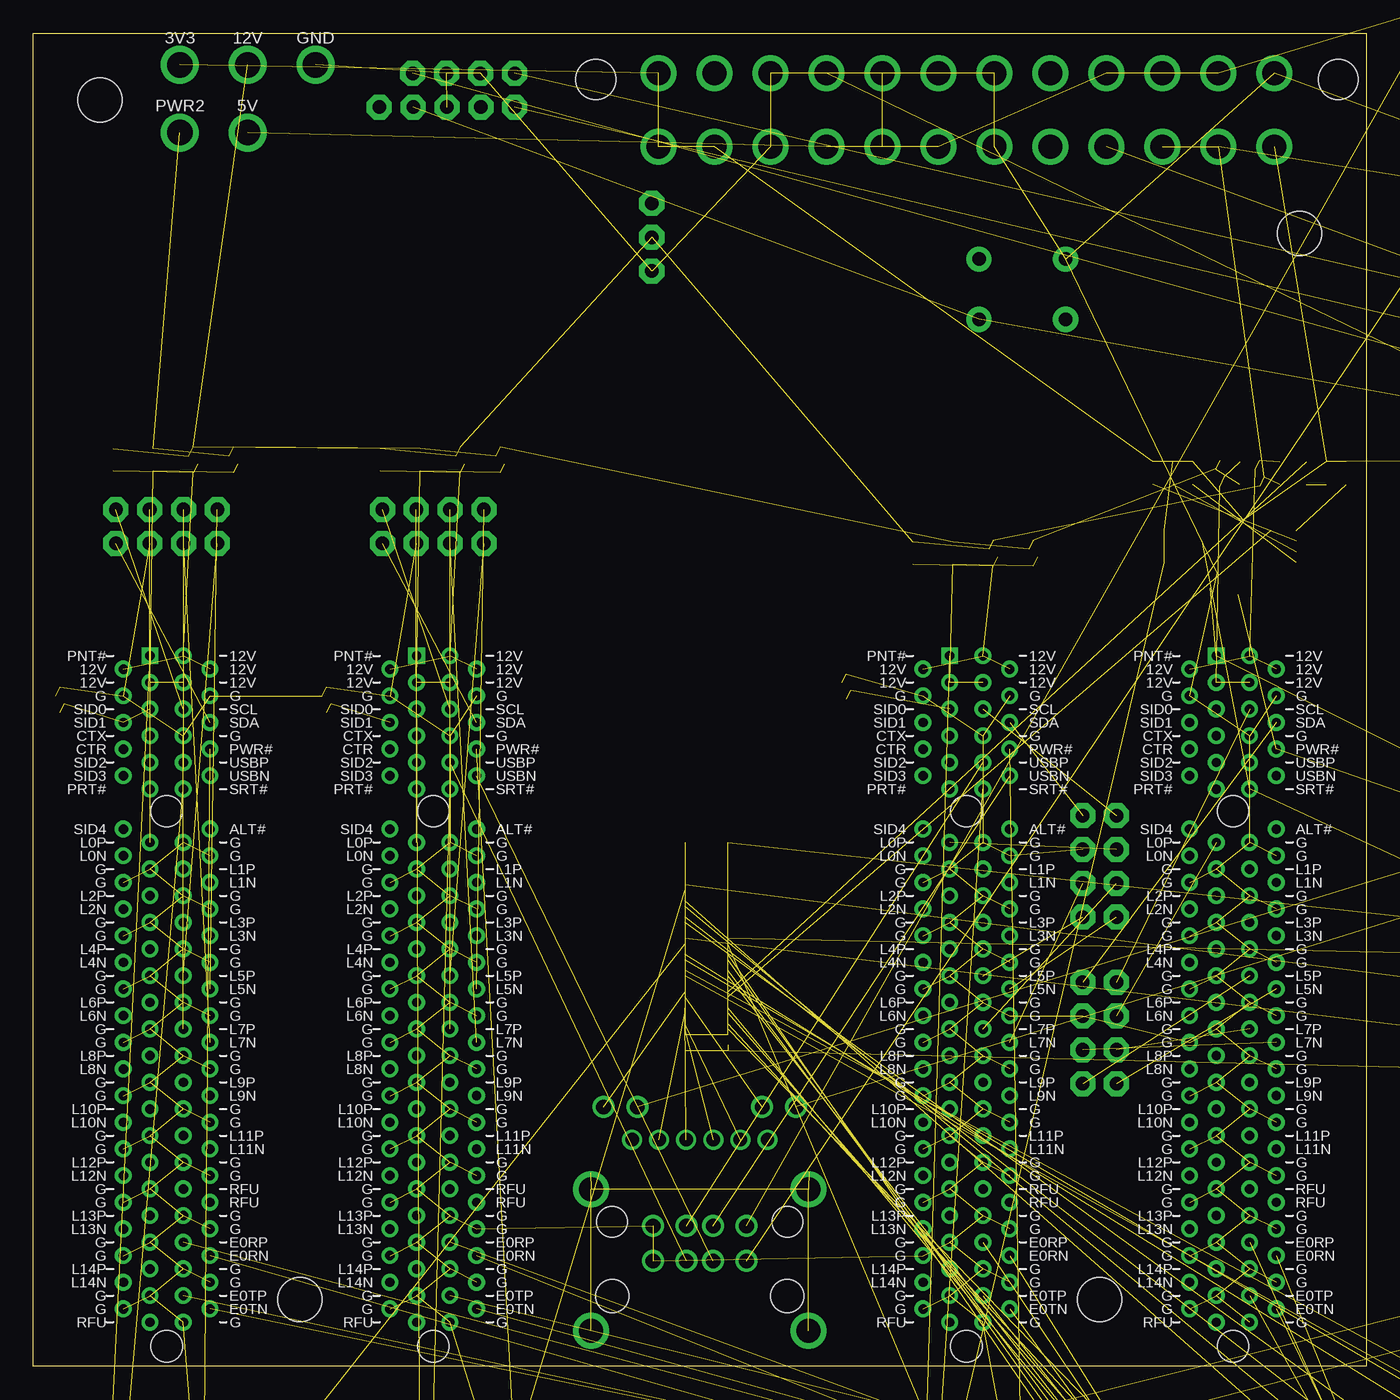
[diagram p3: board, bottom side, seen from below]

Size 100 x 100 mm. Coordinates in mm from the lower left corner, seen from the top.
Outline: 100,100 0,100 0,0 100,0 100,100
Copper layers (1*2*15*16): Top 0.035mm / dielectric 0.2mm / Route2 0.0175mm / dielectric 0.3mm / Route15 0.0175mm / dielectric 0.2mm / Bottom 0.035mm
Design rules "my_SeeedStudio_4layer_DRU_no_angle_20140221": minimum track width 6mil, minimum drill 12mil, track to track 6mil, track to pad 6mil, pad to pad 6mil, via to via 6mil, smd to smd 6mil, copper to edge 15mil, drill to drill 10mil, minimum pad ring 6mil, minimum via ring 6mil, stop-mask expansion 2mil, vias tented up to drill 12mil, thermal gap 10mil

### Footprints (pad centres in the part's own frame; a part is rotated, then mirrored left to right if it is on the bottom)
0603-CAP = smd 1.1 x 1: 1 -0.85,0; 2 0.85,0
CAP-5-2 = drill 0.7 pad 1.5 square: 1 1,0 | drill 0.7 pad 1.5: 2 -1,0
0402-CAP = smd 0.7 x 0.7: 1 -0.65,0; 2 0.65,0
FAN-3PIN = drill 1.016 pad 1.88 octagon: 12V 0,0; GND 2.54,0; TACH -2.54,0
CAP-8-3.5 = drill 0.7 pad 1.651 square: 1 1.75,0 | drill 0.7 pad 1.651: 2 -1.75,0
HOLE_18AWG = drill 1.905: P$1 0,0
HOLE_22AWG = drill 1.016: P 0,0
TESTPAD-1.27 = smd 1.27 x 1.27: P 0,0
TSSOP8 = smd 1.3 x 0.35: 1 -1.975,0.975; 2 -1.975,0.325; 3 -1.975,-0.325; 4 -1.975,-0.975; 5 1.975,-0.975; 6 1.975,-0.325; 7 1.975,0.325; 8 1.975,0.975
0603_LED = smd 0.8 x 1.003: A 0,-0.852; C 0,0.852
0603-RES = smd 1.1 x 1: 1 -0.85,0; 2 0.85,0
0603-ARV = smd 0.45 x 1.1: 1 -1.2,-0.95; 2 -0.4,-0.95; 3 0.4,-0.95; 4 1.2,-0.95; 5 1.2,0.95; 6 0.4,0.95; 7 -0.4,0.95; 8 -1.2,0.95
TACTILE-PTH = drill 1.016 pad 1.88: 1 -3.251,2.261; 2 3.251,2.261; 3 -3.251,-2.261; 4 3.251,-2.261
SB-0603 = smd 0.9 x 1: L1 -0.95,0; R1 0.95,0 | smd 0.4 x 0.35: L2 -0.3,0.325; R2 0.3,-0.325
CVN-V1-CONN = drill 0.7 pad 1.27 square: A1 -11.5,1.25 | drill 0.7 pad 1.27: A2 -10.5,3.25; A3 -9.5,1.25; A4 -8.5,3.25; A5 -7.5,1.25; A6 -6.5,3.25; A7 -5.5,1.25; A8 -4.5,3.25; A9 -3.5,1.25; A10 -2.5,3.25; A11 -1.5,1.25; A12 1.5,3.25; A13 2.5,1.25; A14 3.5,3.25; A15 4.5,1.25; A16 5.5,3.25; A17 6.5,1.25; A18 7.5,3.25; A19 8.5,1.25; A20 9.5,3.25; A21 10.5,1.25; A22 11.5,3.25; A23 12.5,1.25; A24 13.5,3.25; A25 14.5,1.25; A26 15.5,3.25; A27 16.5,1.25; A28 17.5,3.25; A29 18.5,1.25; A30 19.5,3.25; A31 20.5,1.25; A32 21.5,3.25; A33 22.5,1.25; A34 23.5,3.25; A35 24.5,1.25; A36 25.5,3.25; A37 26.5,1.25; A38 27.5,3.25; A39 28.5,1.25; A40 29.5,3.25; A41 30.5,1.25; A42 31.5,3.25; A43 32.5,1.25; A44 33.5,3.25; A45 34.5,1.25; A46 35.5,3.25; A47 36.5,1.25; A48 37.5,3.25; A49 38.5,1.25; B1 -11.5,-1.25; B2 -10.5,-3.25; B3 -9.5,-1.25; B4 -8.5,-3.25; B5 -7.5,-1.25; B6 -6.5,-3.25; B7 -5.5,-1.25; B8 -4.5,-3.25; B9 -3.5,-1.25; B10 -2.5,-3.25; B11 -1.5,-1.25; B12 1.5,-3.25; B13 2.5,-1.25; B14 3.5,-3.25; B15 4.5,-1.25; B16 5.5,-3.25; B17 6.5,-1.25; B18 7.5,-3.25; B19 8.5,-1.25; B20 9.5,-3.25; B21 10.5,-1.25; B22 11.5,-3.25; B23 12.5,-1.25; B24 13.5,-3.25; B25 14.5,-1.25; B26 15.5,-3.25; B27 16.5,-1.25; B28 17.5,-3.25; B29 18.5,-1.25; B30 19.5,-3.25; B31 20.5,-1.25; B32 21.5,-3.25; B33 22.5,-1.25; B34 23.5,-3.25; B35 24.5,-1.25; B36 25.5,-3.25; B37 26.5,-1.25; B38 27.5,-3.25; B39 28.5,-1.25; B40 29.5,-3.25; B41 30.5,-1.25; B42 31.5,-3.25; B43 32.5,-1.25; B44 33.5,-3.25; B45 34.5,-1.25; B46 35.5,-3.25; B47 36.5,-1.25; B48 37.5,-3.25; B49 38.5,-1.25 | hole 2.35: 0.15,0; 40.3,0
DF40-RCP-90 = smd 0.2 x 1: 1 -8.8,-1.6; 2 -8.4,-1.6; 3 -8,-1.6; 4 -7.6,-1.6; 5 -7.2,-1.6; 6 -6.8,-1.6; 7 -6.4,-1.6; 8 -6,-1.6; 9 -5.6,-1.6; 10 -5.2,-1.6; 11 -4.8,-1.6; 12 -4.4,-1.6; 13 -4,-1.6; 14 -3.6,-1.6; 15 -3.2,-1.6; 16 -2.8,-1.6; 17 -2.4,-1.6; 18 -2,-1.6; 19 -1.6,-1.6; 20 -1.2,-1.6; 21 -0.8,-1.6; 22 -0.4,-1.6; 23 0,-1.6; 24 0.4,-1.6; 25 0.8,-1.6; 26 1.2,-1.6; 27 1.6,-1.6; 28 2,-1.6; 29 2.4,-1.6; 30 2.8,-1.6; 31 3.2,-1.6; 32 3.6,-1.6; 33 4,-1.6; 34 4.4,-1.6; 35 4.8,-1.6; 36 5.2,-1.6; 37 5.6,-1.6; 38 6,-1.6; 39 6.4,-1.6; 40 6.8,-1.6; 41 7.2,-1.6; 42 7.6,-1.6; 43 8,-1.6; 44 8.4,-1.6; 45 8.8,-1.6; 46 8.8,1.6; 47 8.4,1.6; 48 8,1.6; 49 7.6,1.6; 50 7.2,1.6; 51 6.8,1.6; 52 6.4,1.6; 53 6,1.6; 54 5.6,1.6; 55 5.2,1.6; 56 4.8,1.6; 57 4.4,1.6; 58 4,1.6; 59 3.6,1.6; 60 3.2,1.6; 61 2.8,1.6; 62 2.4,1.6; 63 2,1.6; 64 1.6,1.6; 65 1.2,1.6; 66 0.8,1.6; 67 0.4,1.6; 68 0,1.6; 69 -0.4,1.6; 70 -0.8,1.6; 71 -1.2,1.6; 72 -1.6,1.6; 73 -2,1.6; 74 -2.4,1.6; 75 -2.8,1.6; 76 -3.2,1.6; 77 -3.6,1.6; 78 -4,1.6; 79 -4.4,1.6; 80 -4.8,1.6; 81 -5.2,1.6; 82 -5.6,1.6; 83 -6,1.6; 84 -6.4,1.6; 85 -6.8,1.6; 86 -7.2,1.6; 87 -7.6,1.6; 88 -8,1.6; 89 -8.4,1.6; 90 -8.8,1.6
2X4 = drill 1.016 pad 1.88 octagon: 1 -3.81,-1.27; 2 -3.81,1.27; 3 -1.27,-1.27; 4 -1.27,1.27; 5 1.27,-1.27; 6 1.27,1.27; 7 3.81,-1.27; 8 3.81,1.27
SOT23-5 = smd 0.55 x 1.2: 1 -0.95,-1.3; 2 0,-1.3; 3 0.95,-1.3; 4 0.95,1.3; 5 -0.95,1.3
STAND-OFF = hole 3.302: 0,0
FRONT-PANEL = drill 1.016 pad 1.88 octagon: HDLED+ -5.12,-2.54; HDLED- -2.58,-2.54; NC 5.04,-2.54; PLED+ -5.12,0; PLED- -2.54,0; PWR_1 0,0; PWR_2 2.54,0; RST_1 -0.04,-2.54; RST_2 2.5,-2.54
ATX-24-VERT = drill 1.8: 1 23.1,-5.5; 2 18.9,-5.5; 3 14.7,-5.5; 4 10.5,-5.5; 5 6.3,-5.5; 6 2.1,-5.5; 7 -2.1,-5.5; 8 -6.3,-5.5; 9 -10.5,-5.5; 10 -14.7,-5.5; 11 -18.9,-5.5; 12 -23.1,-5.5; 13 23.1,0; 14 18.9,0; 15 14.7,0; 16 10.5,0; 17 6.3,0; 18 2.1,0; 19 -2.1,0; 20 -6.3,0; 21 -10.5,0; 22 -14.7,0; 23 -18.9,0; 24 -23.1,0 | hole 3: 27.8,-0.46; -27.9,-0.46
MAGJACK-DUALUSB = drill 1.1: BD+ 1.005,-9.1; BD- -1.005,-9.1; BGND 3.505,-9.1; BVBUS -3.505,-9.1; R7 7.225,2.44; R8 4.685,2.44; R9 -4.685,2.44; R10 -7.225,2.44; TD+ 1.005,-6.48; TD- -1.005,-6.48; TGND 3.505,-6.48; TVBUS -3.505,-6.48 | drill 1: R1 5.075,0; R2 3.045,0; R3 1.015,0; R4 -1.015,0; R5 -3.045,0; R6 -5.075,0 | drill 1.8 pad 2.4: S1 -8.165,-3.73; S2 8.165,-3.73; S3 8.165,-14.35; S4 -8.165,-14.35 | smd 0.5 x 0.5: S7 -8.2,-2.4; S8 8.2,-2.5 | hole 2.3: -6.565,-6.15; 6.565,-6.15 | hole 2.5: -6.565,-11.74; 6.565,-11.74
DF40-RCP-80 = smd 0.2 x 1: 1 -7.8,-1.6; 2 -7.4,-1.6; 3 -7,-1.6; 4 -6.6,-1.6; 5 -6.2,-1.6; 6 -5.8,-1.6; 7 -5.4,-1.6; 8 -5,-1.6; 9 -4.6,-1.6; 10 -4.2,-1.6; 11 -3.8,-1.6; 12 -3.4,-1.6; 13 -3,-1.6; 14 -2.6,-1.6; 15 -2.2,-1.6; 16 -1.8,-1.6; 17 -1.4,-1.6; 18 -1,-1.6; 19 -0.6,-1.6; 20 -0.2,-1.6; 21 0.2,-1.6; 22 0.6,-1.6; 23 1,-1.6; 24 1.4,-1.6; 25 1.8,-1.6; 26 2.2,-1.6; 27 2.6,-1.6; 28 3,-1.6; 29 3.4,-1.6; 30 3.8,-1.6; 31 4.2,-1.6; 32 4.6,-1.6; 33 5,-1.6; 34 5.4,-1.6; 35 5.8,-1.6; 36 6.2,-1.6; 37 6.6,-1.6; 38 7,-1.6; 39 7.4,-1.6; 40 7.8,-1.6; 41 7.8,1.6; 42 7.4,1.6; 43 7,1.6; 44 6.6,1.6; 45 6.2,1.6; 46 5.8,1.6; 47 5.4,1.6; 48 5,1.6; 49 4.6,1.6; 50 4.2,1.6; 51 3.8,1.6; 52 3.4,1.6; 53 3,1.6; 54 2.6,1.6; 55 2.2,1.6; 56 1.8,1.6; 57 1.4,1.6; 58 1,1.6; 59 0.6,1.6; 60 0.2,1.6; 61 -0.2,1.6; 62 -0.6,1.6; 63 -1,1.6; 64 -1.4,1.6; 65 -1.8,1.6; 66 -2.2,1.6; 67 -2.6,1.6; 68 -3,1.6; 69 -3.4,1.6; 70 -3.8,1.6; 71 -4.2,1.6; 72 -4.6,1.6; 73 -5,1.6; 74 -5.4,1.6; 75 -5.8,1.6; 76 -6.2,1.6; 77 -6.6,1.6; 78 -7,1.6; 79 -7.4,1.6; 80 -7.8,1.6

### Placement (x,y rotation side)
C1  -33,101 0 top  (outside the outline)
C2  -29,101 0 top  (outside the outline)
C3  -32,106 0 top  (outside the outline)
C4  -15.5,-45.5 0 top  (outside the outline)
C5  -15.5,-48.5 0 top  (outside the outline)
C6  -15.5,-51.5 0 top  (outside the outline)
C7  -33,121 0 top  (outside the outline)
C8  -29,121 0 top  (outside the outline)
C9  -15.5,-54.5 0 top  (outside the outline)
C10  -15.5,-57.5 0 top  (outside the outline)
C11  -15.5,-60.5 0 top  (outside the outline)
C12  53.6,84.7 270 top
C13  -65,62 0 top  (outside the outline)
C14  -65,56 0 top  (outside the outline)
C15  -65,27 0 top  (outside the outline)
C20  -15.5,-39.5 0 top  (outside the outline)
C21  -15.5,-42.5 0 top  (outside the outline)
C22  -18.5,87 0 top  (outside the outline)
C23  -42.5,-23 0 top  (outside the outline)
C24  -45.5,-23 0 top  (outside the outline)
C25  -45.5,-26.5 0 top  (outside the outline)
C26  -45.5,-29.5 0 top  (outside the outline)
C28  -32,126 0 top  (outside the outline)
C30  -15.5,-15.5 0 top  (outside the outline)
C31  -15.5,-18.5 0 top  (outside the outline)
C32  -15.5,-21.5 0 top  (outside the outline)
C33  -15.5,-24.5 0 top  (outside the outline)
CONN1  89,92.55 180 top
CONN2  78.83,97.63 180 top
CONN3  83.92,97.63 180 top
CONN4  89,97.63 180 top
CONN5  -18,128 0 top  (outside the outline)
CONN6  -18,108 0 top  (outside the outline)
CONN7  83.92,92.55 180 top
CONN8  -63,22 0 top  (outside the outline)
CONN9  -63,16 0 top  (outside the outline)
CONN10  -63,10 0 top  (outside the outline)
IC1  10.2,61.5 90 top
IC2  27.8,-11.5 0 top  (outside the outline)
IC3  65.6,-12 0 top  (outside the outline)
IC4  89.2,-14.7 0 top  (outside the outline)
LED0_1  3,67 180 top
LED0_2  1.5,67 180 top
LED0_3  -97,25 0 top  (outside the outline)
LED0_4  -94,25 0 top  (outside the outline)
LED1_1  -94,36 0 top  (outside the outline)
LED1_2  -97,36 0 top  (outside the outline)
LED1_3  -91,25 0 top  (outside the outline)
LED1_4  -97,21 0 top  (outside the outline)
LPRSNT_1  14.5,67 180 top
LPRSNT_2  26.4,-20.1 0 top  (outside the outline)
LPRSNT_3  64.2,-20.6 0 top  (outside the outline)
LPRSNT_4  87.8,-23.3 0 top  (outside the outline)
LPWR_ON_1  16,67 180 top
LPWR_ON_2  30.9,-15.7 0 top  (outside the outline)
LPWR_ON_3  68.7,-16.2 0 top  (outside the outline)
LPWR_ON_4  92.3,-18.9 0 top  (outside the outline)
LRST_1  13,67 180 top
LRST_2  29.3,-19.6 0 top  (outside the outline)
LRST_3  67.1,-20.1 0 top  (outside the outline)
LRST_4  90.7,-22.8 0 top  (outside the outline)
R1  6.5,67 90 top
R2  9.5,67 90 top
R3  34,61 270 top
R4  31,61 270 top
R5  74,68 270 top
R6  71,68 270 top
R7  94,68 270 top
R8  91,68 270 top
R10  -25,121 0 top  (outside the outline)
R11  -21,121 0 top  (outside the outline)
R12  -25,101 0 top  (outside the outline)
R13  -21,101 0 top  (outside the outline)
R15  -96,65.5 0 top  (outside the outline)
R16  -96,62.5 0 top  (outside the outline)
R17  4.5,67 270 top
R19  -97,29 0 top  (outside the outline)
R21  -97,17 0 top  (outside the outline)
R23  -97,14 0 top  (outside the outline)
R24  -61,68 0 top  (outside the outline)
R25  -61,65 0 top  (outside the outline)
R26  -61,62 0 top  (outside the outline)
R27  -64,59 0 top  (outside the outline)
R28  -64,46 0 top  (outside the outline)
RA1  14.2,61.5 270 top
RA2  6.2,61.5 90 top
RA3  32.8,-10.4 0 top  (outside the outline)
RA4  27.4,-15.3 0 top  (outside the outline)
RA5  70.6,-10.9 0 top  (outside the outline)
RA6  65.2,-15.8 0 top  (outside the outline)
RA7  94.2,-13.6 0 top  (outside the outline)
RA8  88.8,-18.5 0 top  (outside the outline)
S1  25.8,80.8 0 top
S2  -62,32 0 top  (outside the outline)
SB1  8,67 90 top
SB2  11,67 270 top
SB3  28,61 270 top
SB4  25,61 270 top
SB5  68,68 270 top
SB6  65,68 270 top
SB7  88,68 270 top
SB8  85,68 270 top
SB9  39,51 90 top
SB10  78,50 90 top
SB11  98,50 90 top
SB12  -17,121 0 top  (outside the outline)
SB13  -17,101 0 top  (outside the outline)
SOCKET1  10,41.8 270 top
SOCKET2  30,41.8 270 top
SOCKET3  70,41.8 270 top
SOCKET4  90,41.8 270 top
U$1  49.5,32.5 90 top
U$2  20,25 90 top
U$3  20,37.5 90 top
U$4  70,63 0 top
U$5  90,63 0 top
U$6  -27,127 0 top  (outside the outline)
U$7  [STAND-OFF]  95,95 180 top
U$8  [STAND-OFF]  5,85 180 top
U$9  [STAND-OFF]  20,5 180 top
U$10  [STAND-OFF]  80,5 180 top
U$11  69,97 0 top
U$12  -27,107 0 top  (outside the outline)
U$13  30,97 0 top
U$15  50,17 0 top
U$17  81,79.5 180 top

### Tracks (layer width: path | path; a pad name or v marks a point on that pad's centre or on a via)
3.3V  (53 unrouted)
5V  (11 unrouted)
5VSB  (2 unrouted)
12V  (16 unrouted)
12V_0  (5 unrouted)
12V_1  (5 unrouted)
12V_2  (5 unrouted)
12V_3  (5 unrouted)
!PS_ON  (2 unrouted)
B_VBUS  (5 unrouted)
E0_RXN  (1 unrouted)
E0_RXP  (1 unrouted)
E0_SHLD  (5 unrouted)
E0_TXN  (1 unrouted)
E0_TXP  (1 unrouted)
E1_RXN  (1 unrouted)
E1_RXP  (1 unrouted)
E1_TXN  (1 unrouted)
E1_TXP  (1 unrouted)
E2_RXN  (1 unrouted)
E2_RXP  (1 unrouted)
E2_TXN  (1 unrouted)
E2_TXP  (1 unrouted)
E3_RXN  (1 unrouted)
E3_RXP  (1 unrouted)
E3_TXN  (1 unrouted)
E3_TXP  (1 unrouted)
EX_RXN  (1 unrouted)
EX_RXP  (1 unrouted)
EX_TXN  (1 unrouted)
EX_TXP  (1 unrouted)
GND  (228 unrouted)
HOST_VBUS_U  (4 unrouted)
HOST_VBUS_U1  (4 unrouted)
I2C_SCL_0  (1 unrouted)
I2C_SCL_1  (1 unrouted)
I2C_SCL_2  (1 unrouted)
I2C_SCL_3  (1 unrouted)
I2C_SDA_0  (1 unrouted)
I2C_SDA_1  (1 unrouted)
I2C_SDA_2  (1 unrouted)
I2C_SDA_3  (1 unrouted)
LED0_1  (1 unrouted)
LED0_2  (1 unrouted)
LED1_1  (1 unrouted)
LED1_2  (1 unrouted)
LED2_1  (1 unrouted)
LED2_2  (1 unrouted)
LED3_1  (1 unrouted)
LED3_2  (1 unrouted)
LEDX_1  (1 unrouted)
LEDX_2  (1 unrouted)
N$1  (2 unrouted)
N$2  (3 unrouted)
N$3  (2 unrouted)
N$4  (1 unrouted)
N$5  (1 unrouted)
N$6  (1 unrouted)
N$7  (1 unrouted)
N$8  (1 unrouted)
N$9
  Top 0.152: IC1.7 9.88,62.48 9.3,61.9 RA2.3
N$10
  Top 0.152: IC1.5 11.18,62.38 9.9,61.1 RA2.2
N$11
  Top 0.152: IC1.2 9.88,60.33 9.5,60.7 8.6,60.7 8.2,60.3 RA2.1
N$12  (1 unrouted)
N$13  (1 unrouted)
N$14  (1 unrouted)
N$15  (1 unrouted)
N$16  (1 unrouted)
N$17  (1 unrouted)
N$18  (1 unrouted)
N$19  (1 unrouted)
N$20  (1 unrouted)
N$21  (1 unrouted)
N$22  (1 unrouted)
N$23  (1 unrouted)
N$24  (1 unrouted)
N$25  (1 unrouted)
N$26  (1 unrouted)
N$27  (1 unrouted)
N$28  (1 unrouted)
N$29  (1 unrouted)
N$30  (1 unrouted)
N$31  (1 unrouted)
N$34  (1 unrouted)
N$35  (1 unrouted)
N$39  (1 unrouted)
N$40  (1 unrouted)
N$41  (1 unrouted)
N$42  (1 unrouted)
N$43  (1 unrouted)
N$44  (1 unrouted)
N$45  (1 unrouted)
N$46  (1 unrouted)
N$49  (1 unrouted)
N$50  (1 unrouted)
N$51  (1 unrouted)
N$52  (1 unrouted)
N$53  (1 unrouted)
N$54  (1 unrouted)
N$55  (1 unrouted)
N$56  (1 unrouted)
N$57  (1 unrouted)
N$58  (1 unrouted)
N$59  (1 unrouted)
N$60  (1 unrouted)
N$61  (1 unrouted)
N$62  (1 unrouted)
N$63  (1 unrouted)
N$96  (1 unrouted)
PRSNT#_0  (2 unrouted)
  Top 0.152: RA1.3 12.5,61.1 12.1,60.7 12.1,58.8 11.7,58.4 10.8,58.4 10.53,58.67 IC1.3
PRSNT#_1  (2 unrouted)
PRSNT#_2  (2 unrouted)
PRSNT#_3  (2 unrouted)
PWR2  (12 unrouted)
PWR2_0  (4 unrouted)
PWR2_1  (4 unrouted)
PWR2_2  (4 unrouted)
PWR2_3  (4 unrouted)
PWR_BUT  (3 unrouted)
PWR_ON#_0  (2 unrouted)
  Top 0.152: RA1.4 13.25,59.15 12,57.9 9.6,57.9 9.22,58.27 IC1.1
PWR_ON#_1  (2 unrouted)
PWR_ON#_2  (2 unrouted)
PWR_ON#_3  (2 unrouted)
RESET_BUT  (3 unrouted)
SPI_CLK_0  (1 unrouted)
SPI_CLK_1  (1 unrouted)
SPI_CLK_2  (1 unrouted)
SPI_CLK_3  (1 unrouted)
SPI_CS_0  (1 unrouted)
SPI_CS_1  (1 unrouted)
SPI_CS_2  (1 unrouted)
SPI_CS_3  (1 unrouted)
SPI_MISO_0  (1 unrouted)
SPI_MISO_1  (1 unrouted)
SPI_MISO_2  (1 unrouted)
SPI_MISO_3  (1 unrouted)
SPI_MOSI_0  (1 unrouted)
SPI_MOSI_1  (1 unrouted)
SPI_MOSI_2  (1 unrouted)
SPI_MOSI_3  (1 unrouted)
SYS_RESET#_0  (2 unrouted)
  Top 0.152: RA1.2 12.3,61.9 12,62.2 12,64.2 11.6,64.6 10.9,64.6 10.53,64.22 IC1.6
SYS_RESET#_1  (2 unrouted)
SYS_RESET#_2  (2 unrouted)
SYS_RESET#_3  (2 unrouted)
T_VBUS  (5 unrouted)
UBOOT_0  (1 unrouted)
UBOOT_1  (1 unrouted)
UBOOT_2  (1 unrouted)
UBOOT_3  (1 unrouted)
USB_N_2  (1 unrouted)
USB_N_3  (1 unrouted)
USB_P_2  (1 unrouted)
USB_P_3  (1 unrouted)
(copper drawn outside any net)
  shapes: Top area x1